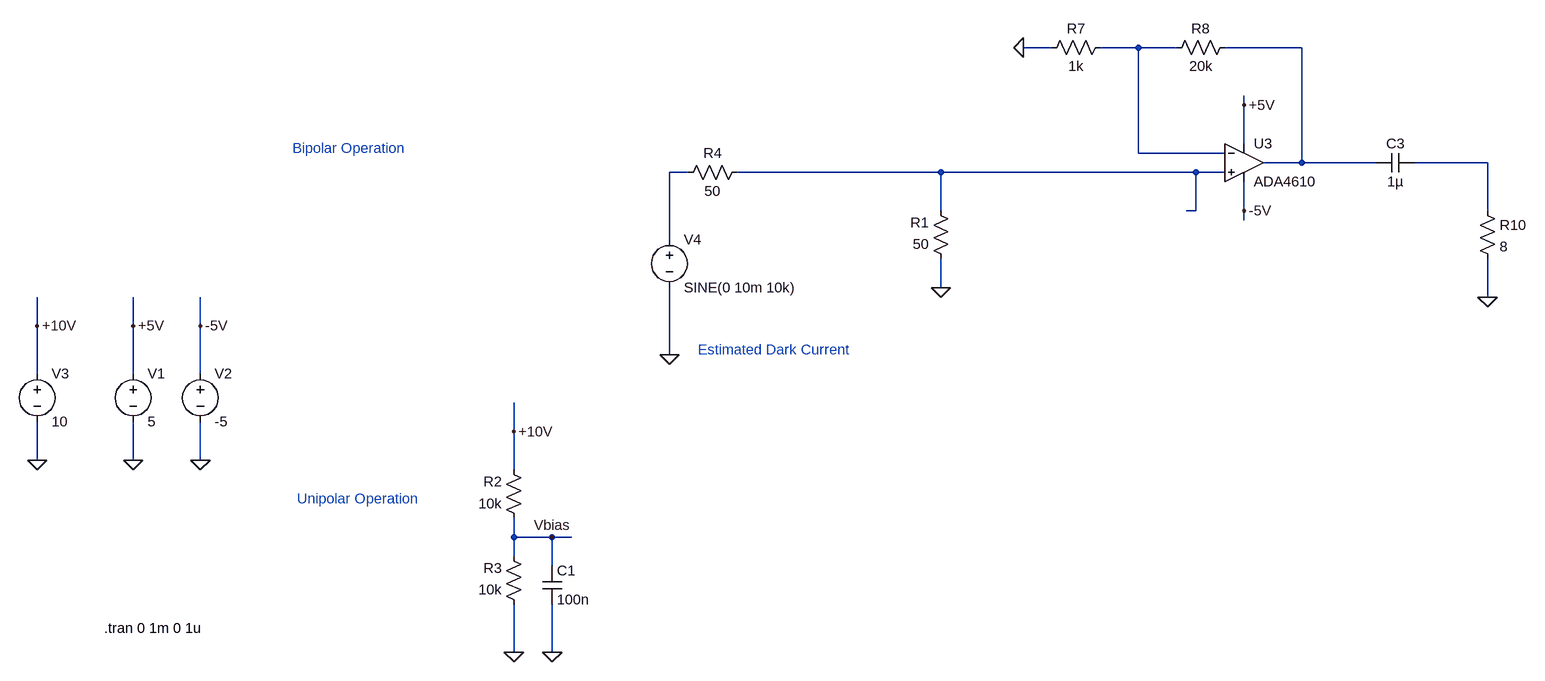
[diagram p0: schematic LM833N_Headphone.asc]
LM833N_Headphone.asc, the LTspice schematic file:
Version 4
SHEET 1 3412 768
WIRE 1664 -448 1616 -448
WIRE 1808 -448 1744 -448
WIRE 1872 -448 1808 -448
WIRE 2080 -448 1952 -448
WIRE 1984 -352 1984 -368
WIRE 1984 -288 1984 -352
WIRE 1808 -272 1808 -448
WIRE 1952 -272 1808 -272
WIRE 2080 -256 2080 -448
WIRE 2080 -256 2016 -256
WIRE 2576 -256 2080 -256
WIRE 2880 -256 2640 -256
WIRE 848 -240 816 -240
WIRE 1472 -240 928 -240
WIRE 1904 -240 1472 -240
WIRE 1952 -240 1904 -240
WIRE 1472 -176 1472 -240
WIRE 1904 -176 1904 -240
WIRE 1904 -176 1888 -176
WIRE 1984 -176 1984 -224
WIRE 2880 -176 2880 -256
WIRE 1984 -160 1984 -176
WIRE 816 -128 816 -240
WIRE 1472 -48 1472 -96
WIRE 2880 -32 2880 -96
WIRE -1008 16 -1008 -32
WIRE -848 16 -848 -32
WIRE -736 16 -736 -32
WIRE 816 64 816 -48
WIRE -1008 96 -1008 16
WIRE -848 96 -848 16
WIRE -736 96 -736 16
WIRE 480 192 480 144
WIRE -1008 240 -1008 176
WIRE -848 240 -848 176
WIRE -736 240 -736 176
WIRE 480 256 480 192
WIRE 480 368 480 336
WIRE 544 368 480 368
WIRE 576 368 544 368
WIRE 480 400 480 368
WIRE 544 416 544 368
WIRE 480 560 480 480
WIRE 544 560 544 480
FLAG -848 240 0
FLAG -848 16 +5V
FLAG -736 240 0
FLAG -736 16 -5V
FLAG 480 192 +10V
FLAG 544 368 Vbias
FLAG 544 560 0
FLAG -1008 240 0
FLAG -1008 16 +10V
FLAG 480 560 0
FLAG 1984 -176 -5V
FLAG 1984 -352 +5V
FLAG 2880 -32 0
FLAG 1472 -48 0
FLAG 1616 -448 0
FLAG 816 64 0
SYMBOL voltage -848 80 R0
WINDOW 123 0 0 Left 0
WINDOW 39 0 0 Left 0
SYMATTR InstName V1
SYMATTR Value 5
SYMBOL voltage -736 80 R0
WINDOW 123 0 0 Left 0
WINDOW 39 0 0 Left 0
SYMATTR InstName V2
SYMATTR Value -5
SYMBOL res 496 352 R180
WINDOW 0 36 76 Left 2
WINDOW 3 36 40 Left 2
SYMATTR InstName R2
SYMATTR Value 10k
SYMBOL res 496 496 R180
WINDOW 0 36 76 Left 2
WINDOW 3 36 40 Left 2
SYMATTR InstName R3
SYMATTR Value 10k
SYMBOL cap 528 416 R0
SYMATTR InstName C1
SYMATTR Value 100n
SYMBOL res 944 -256 R90
WINDOW 0 0 56 VBottom 2
WINDOW 3 32 56 VTop 2
SYMATTR InstName R4
SYMATTR Value 50
SYMBOL voltage -1008 80 R0
WINDOW 123 0 0 Left 0
WINDOW 39 0 0 Left 0
SYMATTR InstName V3
SYMATTR Value 10
SYMBOL OpAmps\\ADA4610 1984 -320 R0
SYMATTR InstName U3
SYMBOL res 1648 -432 R270
WINDOW 0 32 56 VTop 2
WINDOW 3 0 56 VBottom 2
SYMATTR InstName R7
SYMATTR Value 1k
SYMBOL res 1856 -432 R270
WINDOW 0 32 56 VTop 2
WINDOW 3 0 56 VBottom 2
SYMATTR InstName R8
SYMATTR Value 20k
SYMBOL res 2864 -192 R0
SYMATTR InstName R10
SYMATTR Value 8
SYMBOL cap 2576 -240 R270
WINDOW 0 32 32 VTop 2
WINDOW 3 0 32 VBottom 2
SYMATTR InstName C3
SYMATTR Value 1µ
SYMBOL voltage 816 -144 R0
WINDOW 123 0 0 Left 0
WINDOW 39 0 0 Left 0
SYMATTR InstName V4
SYMATTR Value SINE(0 10m 10k)
SYMBOL res 1488 -80 R180
WINDOW 0 36 76 Left 2
WINDOW 3 36 40 Left 2
SYMATTR InstName R1
SYMATTR Value 50
TEXT -896 520 Left 2 !.tran 0 1m 0 1u
TEXT -144 -280 Left 2 ;Bipolar Operation
TEXT -136 304 Left 2 ;Unipolar Operation
TEXT 864 56 Left 2 ;Estimated Dark Current

The netlist it stands for:
* LM833N_Headphone.asc
V1 +5V 0 5
V2 -5V 0 -5
R2 Vbias +10V 10k
R3 0 Vbias 10k
C1 Vbias 0 100n
R4 N005 N004 50
V3 +10V 0 10
XU3 N005 N001 +5V -5V N002 ADA4610  ; pins In+ In- V+ V- OUT
R7 0 N001 1k
R8 N001 N002 20k
R10 N003 0 8
C3 N002 N003 1µ
V4 N004 0 SINE(0 10m 10k)
R1 0 N005 50
.tran 0 1m 0 1u
* Bipolar Operation
* Unipolar Operation
* Estimated Dark Current
.backanno
.end